# Altium schematic sheet ic.SchDoc
size A4; SheetNumber: 3; SheetTotal: 4
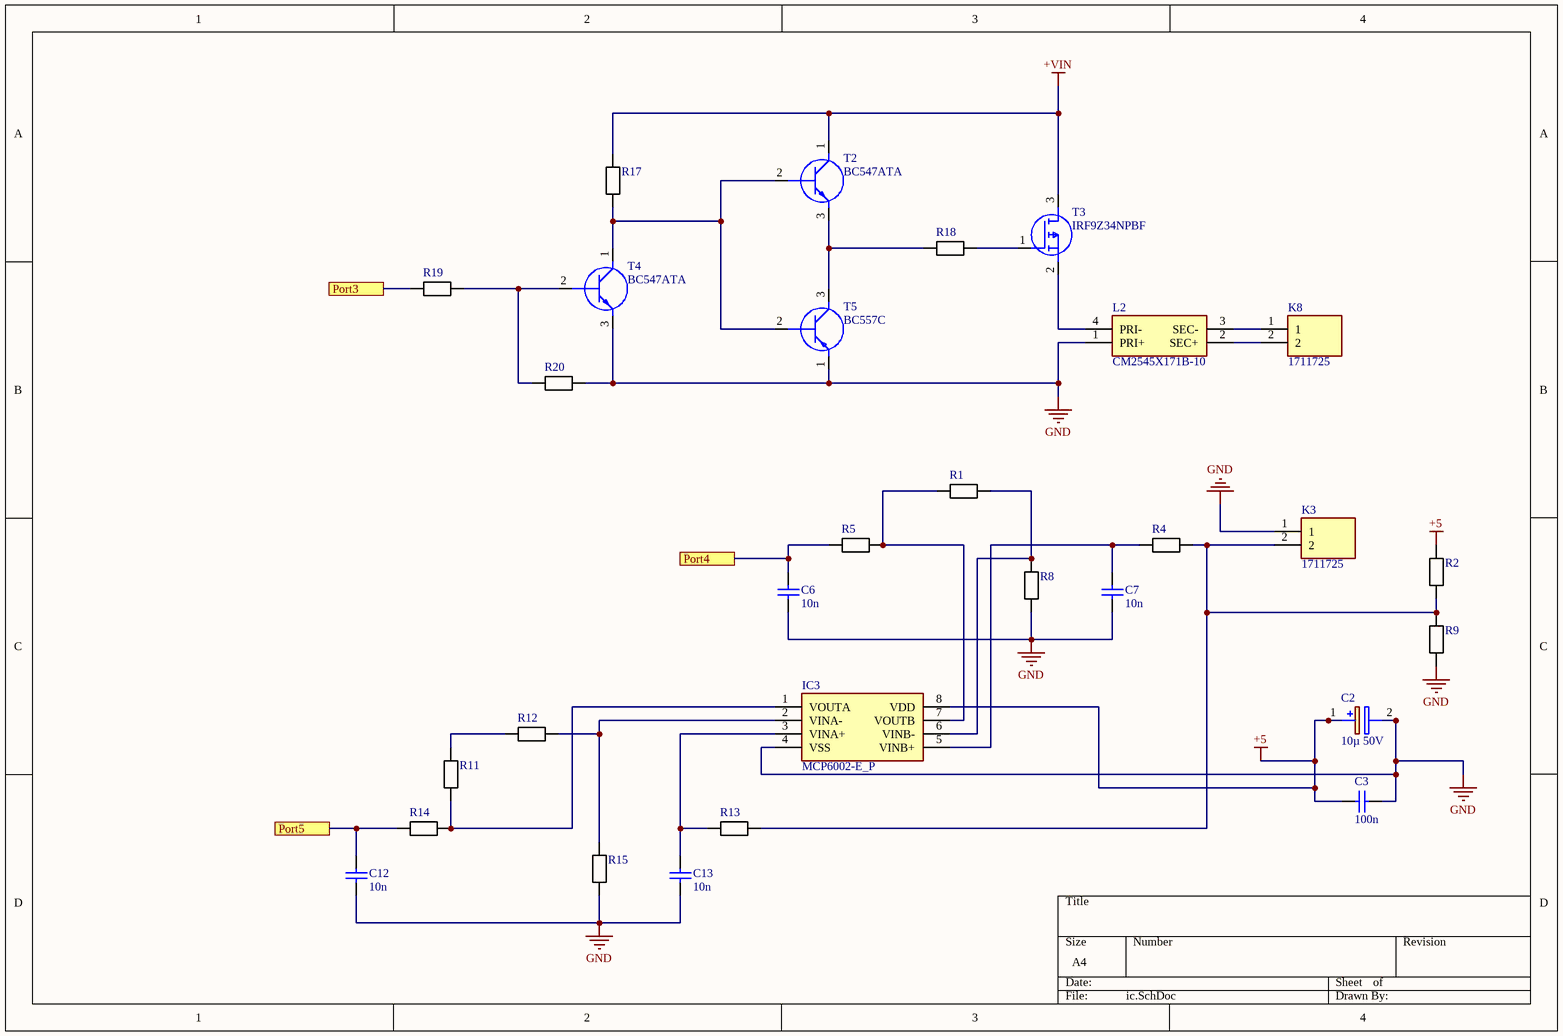
[diagram p0: ic.SchDoc]

## Parts
C2  10µ 50V  [CAPPRD500W65D1025H1250]
C3  100n  [LIBRARYSOURCE=Vault]
C6  10n  [LIBRARYSOURCE=Vault]
C7  10n  [LIBRARYSOURCE=Vault]
C12  10n  [LIBRARYSOURCE=Vault]
C13  10n  [LIBRARYSOURCE=Vault]
IC3  MCP6002-E_P  [DIP781W56P254L950H533Q8N]
K3  1711725  [1711725]
K8  1711725  [1711725]
L2  CM2545X171B-10  [CM2545X171B10]
R1  CRCW08050000Z0EA  [RESC2012X65N]  (value not drawn)
R2  CRCW08050000Z0EA  [RESC2012X65N]  (value not drawn)
R4  CRCW08050000Z0EA  [RESC2012X65N]  (value not drawn)
R5  CRCW08050000Z0EA  [RESC2012X65N]  (value not drawn)
R8  CRCW08050000Z0EA  [RESC2012X65N]  (value not drawn)
R9  CRCW08050000Z0EA  [RESC2012X65N]  (value not drawn)
R11  CRCW08050000Z0EA  [RESC2012X65N]  (value not drawn)
R12  CRCW08050000Z0EA  [RESC2012X65N]  (value not drawn)
R13  CRCW08050000Z0EA  [RESC2012X65N]  (value not drawn)
R14  CRCW08050000Z0EA  [RESC2012X65N]  (value not drawn)
R15  CRCW08050000Z0EA  [RESC2012X65N]  (value not drawn)
R17  CRCW08050000Z0EA  [RESC2012X65N]  (value not drawn)
R18  CRCW08050000Z0EA  [RESC2012X65N]  (value not drawn)
R19  CRCW08050000Z0EA  [RESC2012X65N]  (value not drawn)
R20  CRCW08050000Z0EA  [RESC2012X65N]  (value not drawn)
T2  BC547ATA  [TO-92_(TO-226)]
T3  IRF9Z34NPBF  [TO254P469X1042X1967-3P]
T4  BC547ATA  [TO-92_(TO-226)]
T5  BC557C  [BC557C]

## Ports
Port3, Port4, Port5

## Nets
+5: C2.1(+) C3.1 IC3.8(VDD) R2.2
+VIN: R17.2 T2.1(C) T3.3(D)
GND: C2.2(-) C3.2 C6.1 C7.1 C12.1 C13.1 IC3.4(VSS) K3.1 L2.1(PRI+) R8.1 R9.1 R15.1 R20.2 T4.3(E) T5.1(E)
Port3: R19.1 ; port Port3
Port4: C6.2 R5.1 ; port Port4
Port5: C12.2 R14.1 ; port Port5
NetC7_2: C7.2 IC3.5(VINB+) R4.1
NetC13_2: C13.2 IC3.3(VINA+) R13.1
NetIC3_1: IC3.1(VOUTA) R11.1 R14.2
NetIC3_2: IC3.2(VINA-) R12.2 R15.2
NetIC3_6: IC3.6(VINB-) R1.2 R8.2
NetIC3_7: IC3.7(VOUTB) R1.1 R5.2
NetK3_2: K3.2 R2.1 R4.2 R9.2 R13.2
NetK8_1: K8.1 L2.3(SEC-)
NetK8_2: K8.2 L2.2(SEC+)
NetL2_4: L2.4(PRI-) T3.2(S)
NetR11_2: R11.2 R12.1
NetR17_1: R17.1 T2.2(B) T4.1(C) T5.2(B)
NetR18_1: R18.1 T2.3(E) T5.3(C)
NetR18_2: R18.2 T3.1(G)
NetR19_2: R19.2 R20.1 T4.2(B)

## Library data of the parts
C2 = B41851A6227M000: Capacitor Polarised; Manufacturer_Name: TDK; Datasheet Link: https://altium.componentsearchengine.com/Datasheets/1/B41851A6227M000.pdf; Height: 12.5mm; Manufacturer_Part_Number: B41851A6227M000; Mouser Part Number: 871-B41851A6227M000; Mouser Price/Stock: http://www.mouser.com/Search/ProductDetail.aspx?qs=DFkWJ3l%252bHdIsXImfYI6EYQ%3d%3d; Arrow Part Number: B41851A6227M000; Arrow Price/Stock: https://www.arrow.com/en/products/b41851a6227m000/epcos-tdk
C3 C6 C7 C12 C13 = CAP: Part Number: 02015A270JAT2A; Manufacturer: AVX Interconnect / Elco
IC3 = MCP6002-E_P: Integrated Circuit; Manufacturer_Name: Microchip; Manufacturer_Part_Number: MCP6002-E/P; Datasheet Link: http://componentsearchengine.com/Datasheets/3/MCP6002-E_P.pdf; Height: 5.334mm; Mouser Part Number: 579-MCP6002-E/P; Mouser Price/Stock: https://www.mouser.co.uk/ProductDetail/Microchip-Technology/MCP6002-E-P?qs=hul3WK2zl4pqRWzdnAsu%2FQ%3D%3D; Arrow Part Number: MCP6002-E/P; Arrow Price/Stock: https://www.arrow.com/en/products/mcp6002-ep/microchip-technology?region=nac
K3 K8 = 1711725: Connector; Manufacturer_Name: Phoenix Contact; Datasheet Link: http://www.phoenixcontact.com/de/produkte/1711725/pdf; Height: 18.2mm; Manufacturer_Part_Number: 1711725; Mouser Part Number: 651-1711725; Mouser Price/Stock: https://www.mouser.co.uk/ProductDetail/Phoenix-Contact/1711725?qs=F79NelsxgYFLEb9U5DotcA%3D%3D; Arrow Part Number: 1711725; Arrow Price/Stock: https://www.arrow.com/en/products/1711725/phoenix-contact?region=nac
L2 = CM2545X171B-10: Transformer; Manufacturer_Name: Laird Technologies; Datasheet Link: https://datasheet.datasheetarchive.com/originals/dk/DKDS-7/122753.pdf; Height: 9.5mm; Manufacturer_Part_Number: CM2545X171B-10; Mouser Part Number: N/A; Mouser Price/Stock: https://www.mouser.co.uk/ProductDetail/Laird/CM2545X171B-10?qs=PzGy0jfpSMtNfkEypgU65A%3D%3D; Arrow Part Number: CM2545X171B-10; Arrow Price/Stock: https://www.arrow.com/en/products/cm2545x171b-10/laird-technologies
R1 R2 R4 R5 R8 R9 R11-R15 R17-R20 = RES: Manufacturer: Vishay Dale; Part Number: CRCW08050000Z0EA
T2 T4 = BC547ATA: Transistor BJT NPN; Manufacturer_Name: ON Semiconductor; Datasheet Link: https://www.onsemi.com/pub/Collateral/BC550-D.pdf; Manufacturer_Part_Number: BC547ATA; Mouser Part Number: 512-BC547ATA; Mouser Price/Stock: https://www.mouser.co.uk/ProductDetail/ON-Semiconductor-Fairchild/BC547ATA?qs=ljbEvF4DwOMRdLfuzO8N4w%3D%3D; Arrow Part Number: BC547ATA; Arrow Price/Stock: https://www.arrow.com/en/products/bc547ata/on-semiconductor?region=europe
T3 = IRF9Z34NPBF: MOSFET (P-Channel); Manufacturer_Name: Infineon; Datasheet Link: https://www.infineon.com/dgdl/irf9z34npbf.pdf?fileId=5546d462533600a40153561220af1ddd; Height: 4.69mm; Manufacturer_Part_Number: IRF9Z34NPBF; Mouser Part Number: 942-IRF9Z34NPBF; Mouser Price/Stock: https://www.mouser.co.uk/ProductDetail/Infineon-IR/IRF9Z34NPBF?qs=9%252BKlkBgLFf16a%2FvlD%252BMCtQ%3D%3D; Arrow Part Number: IRF9Z34NPBF; Arrow Price/Stock: https://www.arrow.com/en/products/irf9z34npbf/infineon-technologies-ag?region=nac
T5 = BC557C: Transistor BJT PNP; Manufacturer_Name: NXP; Datasheet Link: http://uk.rs-online.com/web/p/products/1124775; Height: 5.2mm; Manufacturer_Part_Number: BC557C; Mouser Part Number: 771-BC557C; Mouser Price/Stock: https://www.mouser.co.uk/ProductDetail/NXP-Semiconductors/BC557C?qs=84A%2FDAdkstLO1yR4NjQrgg%3D%3D